# Altium project PCBA_SPS_3_0_OUTPUT_TERMINALS.PrjPcb
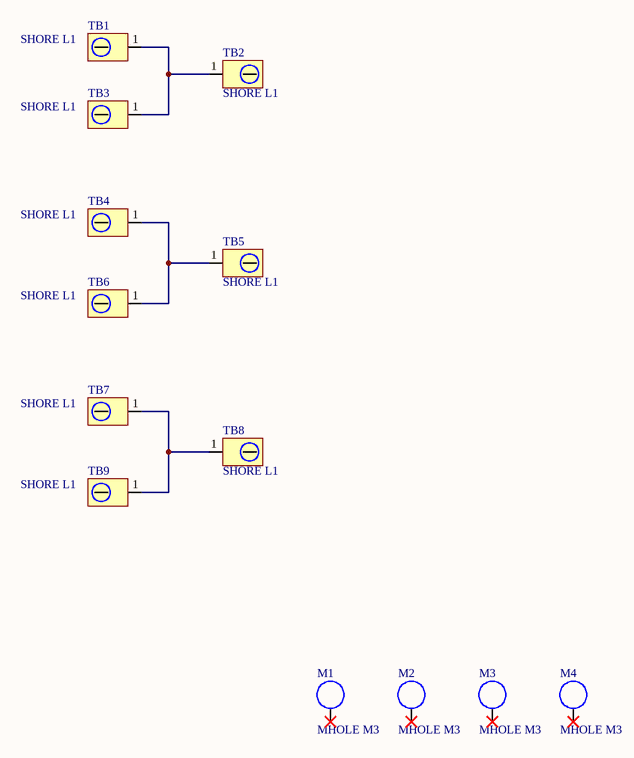
[diagram p0: Sheet1.SchDoc]
1 sheet, 13 parts. Net scope: global (net labels, ports and power ports of the same name join across sheets).
Board file: PCB_SPS_3_0_OUTPUT_TERMINALS.PcbDoc

## Sheet Sheet1.SchDoc
size B; SheetNumber: 1; SheetTotal: 1

### Parts
M1  MHOLE M3  [MHOLE_M3]
M2  MHOLE M3  [MHOLE_M3]
M3  MHOLE M3  [MHOLE_M3]
M4  MHOLE M3  [MHOLE_M3]
TB1  SHORE L1  [B6A-PCB-XX]
TB2  SHORE L1  [B6A-PCB-XX]
TB3  SHORE L1  [B6A-PCB-XX]
TB4  SHORE L1  [B6A-PCB-XX]
TB5  SHORE L1  [B6A-PCB-XX]
TB6  SHORE L1  [B6A-PCB-XX]
TB7  SHORE L1  [B6A-PCB-XX]
TB8  SHORE L1  [B6A-PCB-XX]
TB9  SHORE L1  [B6A-PCB-XX]

### Nets
NetTB1_1: TB1.1 TB2.1 TB3.1
NetTB4_1: TB4.1 TB5.1 TB6.1
NetTB7_1: TB7.1 TB8.1 TB9.1

Not connected (* = marked no-connect by the designer): M1 1*; M2 1*; M3 1*; M4 1*

### Library data of the parts
TB1-TB9 = ScrewLug_6awg